# EAGLE design PAM8320 Amplifier Board R2 (EAGLE 9.6.2)
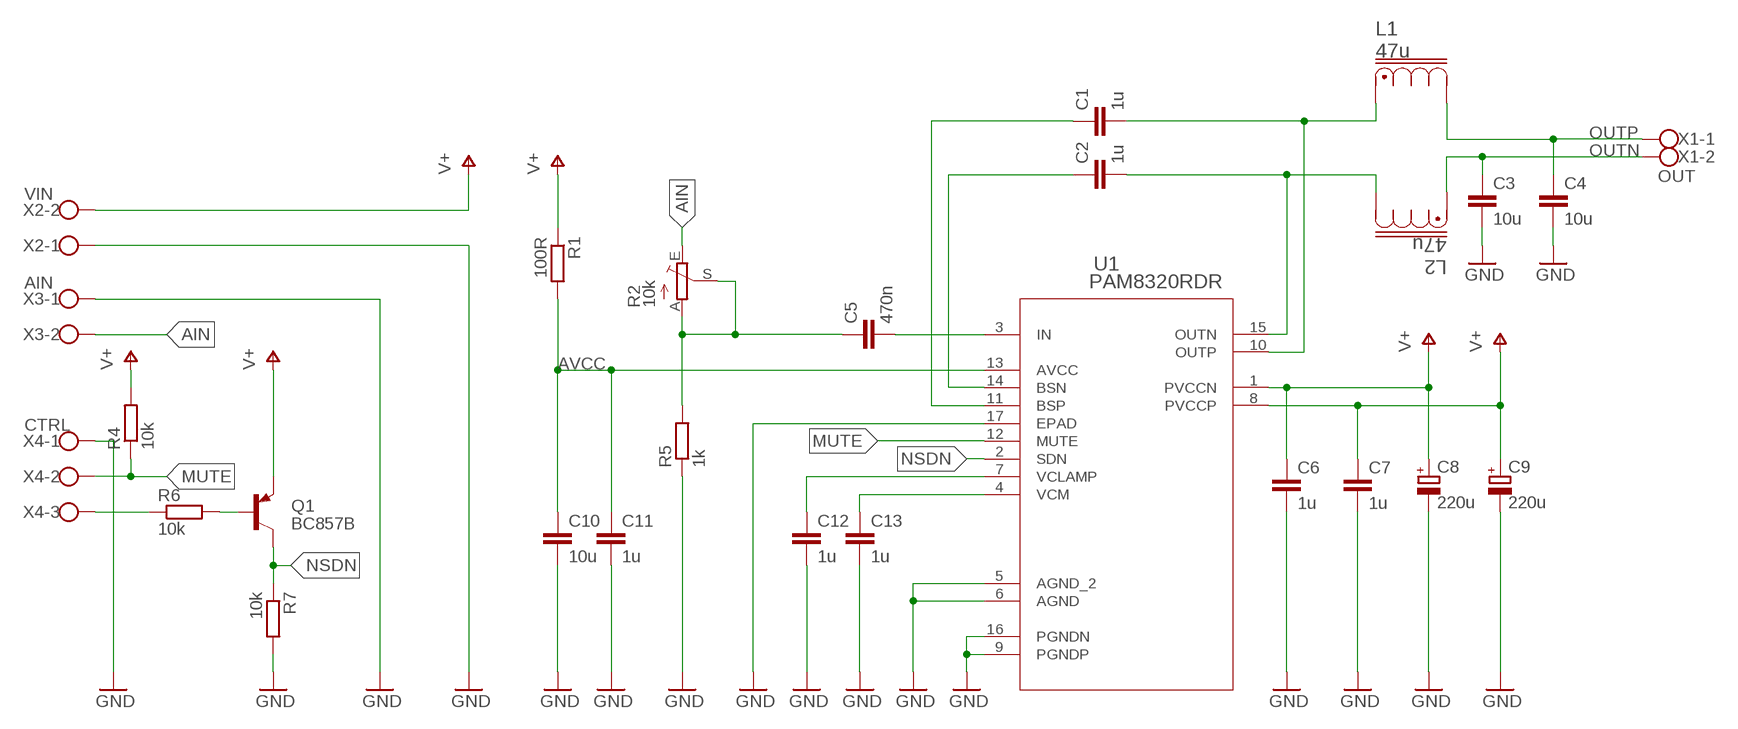
[diagram p0: schematic, sheet 1]

## Parts
C1  1u  C-EUC0805  [C0805]
C2  1u  C-EUC0805  [C0805]
C3  10u  C-EUC1206  [C1206]
C4  10u  C-EUC1206  [C1206]
C5  470n  C-EUC1206  [C1206]
C6  1u  C-EUC0805  [C0805]
C7  1u  C-EUC0805  [C0805]
C8  220u  CPOL-EUUD-10X10  [UD-10X10_NICHICON]
C9  220u  CPOL-EUUD-10X10  [UD-10X10_NICHICON]
C10  10u  C-EUC1206  [C1206]
C11  1u  C-EUC0805  [C0805]
C12  1u  C-EUC0805  [C0805]
C13  1u  C-EUC0805  [C0805]
L1  47u  DR127-470-R  [DR127]
L2  47u  DR127-470-R  [DR127]
Q1  BC857B  BC857BSMD  [SOT23-BEC]
R1  100R  R-EU_R0603  [R0603]
R2  10k  TRIM_EU-RJ9W  [RJ9W]
R4  10k  R-EU_R0603  [R0603]
R5  1k  R-EU_R0603  [R0603]
R6  10k  R-EU_R0603  [R0603]
R7  10k  R-EU_R0603  [R0603]
U1  PAM8320RDR  [SO-16EP_3P9X9P9_DIO]
X1  OUT  W237-102  [W237-102]
X2  VIN  W237-102  [W237-102]
X3  AIN  W237-102  [W237-102]
X4  CTRL  W237-103  [W237-103]

## Nets
AIN: R2.E X3.2
AVCC: C10.1 C11.1 R1.2 U1.13(AVCC)
BSN: C2.1 U1.14(BSN)
BSP: C1.1 U1.11(BSP)
GND: C3.2 C4.2 C6.2 C7.2 C8.- C9.- C10.2 C11.2 C12.2 C13.2 R5.1 R7.2 U1.5(AGND_2) U1.6(AGND) U1.9(PGNDP) U1.16(PGNDN) U1.17(EPAD) X2.1 X3.1 X4.1
MUTE: R4.1 U1.12(MUTE) X4.2
N$1: Q1.B R6.2
N$2: C12.1 U1.7(VCLAMP)
N$3: C13.1 U1.4(VCM)
N$5: C5.1 R2.A R2.S R5.2
N$6: C5.2 U1.3(IN)
N$7: R6.1 X4.3
NSDN: Q1.C R7.1 U1.2(SDN)
OUT_N: C2.2 L2.2 U1.15(OUTN)
OUT_P: C1.2 L1.1 U1.10(OUTP)
OUTN: C3.1 L2.1 X1.2
OUTP: C4.1 L1.2 X1.1
V+: C6.1 C7.1 C8.+ C9.+ Q1.E R1.1 R4.2 U1.1(PVCCN) U1.8(PVCCP) X2.2

## Library data of the parts
C1-C7 C10-C13 = rcl:C-EU: CAPACITOR, European symbol; SPICEPREFIX: C
C8 C9 = rcl:CPOL-EU: POLARIZED CAPACITOR, European symbol; SPICEPREFIX: C
L1 L2 = user:DR127-470-R: DR127 series SMD power inductor; COPYRIGHT: Copyright (C) 2023 Ultra Librarian. All rights reserved.; MANUFACTURER_PART_NUMBER: DR127-470-R; MFR_NAME: Eaton
Q1 = transistor-pnp:BC857*: PNP Transistror
R1 R4-R7 = rcl:R-EU_: RESISTOR, European symbol; SPICEPREFIX: R
R2 = pot:TRIM_EU-: POTENTIOMETER
U1 = user:PAM8320RDR; COPYRIGHT: Copyright (C) 2023 Ultra Librarian. All rights reserved.; MANUFACTURER_PART_NUMBER: PAM8320RDR; MFR_NAME: Diodes Inc
X1-X3 = con-wago-500:W237-102: WAGO SCREW CLAMP; MPN: 237-102; OC_FARNELL: unknown; OC_NEWARK: 70K9898
X4 = con-wago-500:W237-103: WAGO SCREW CLAMP; MPN: 237-103; OC_FARNELL: unknown; OC_NEWARK: 18M7116

## Board
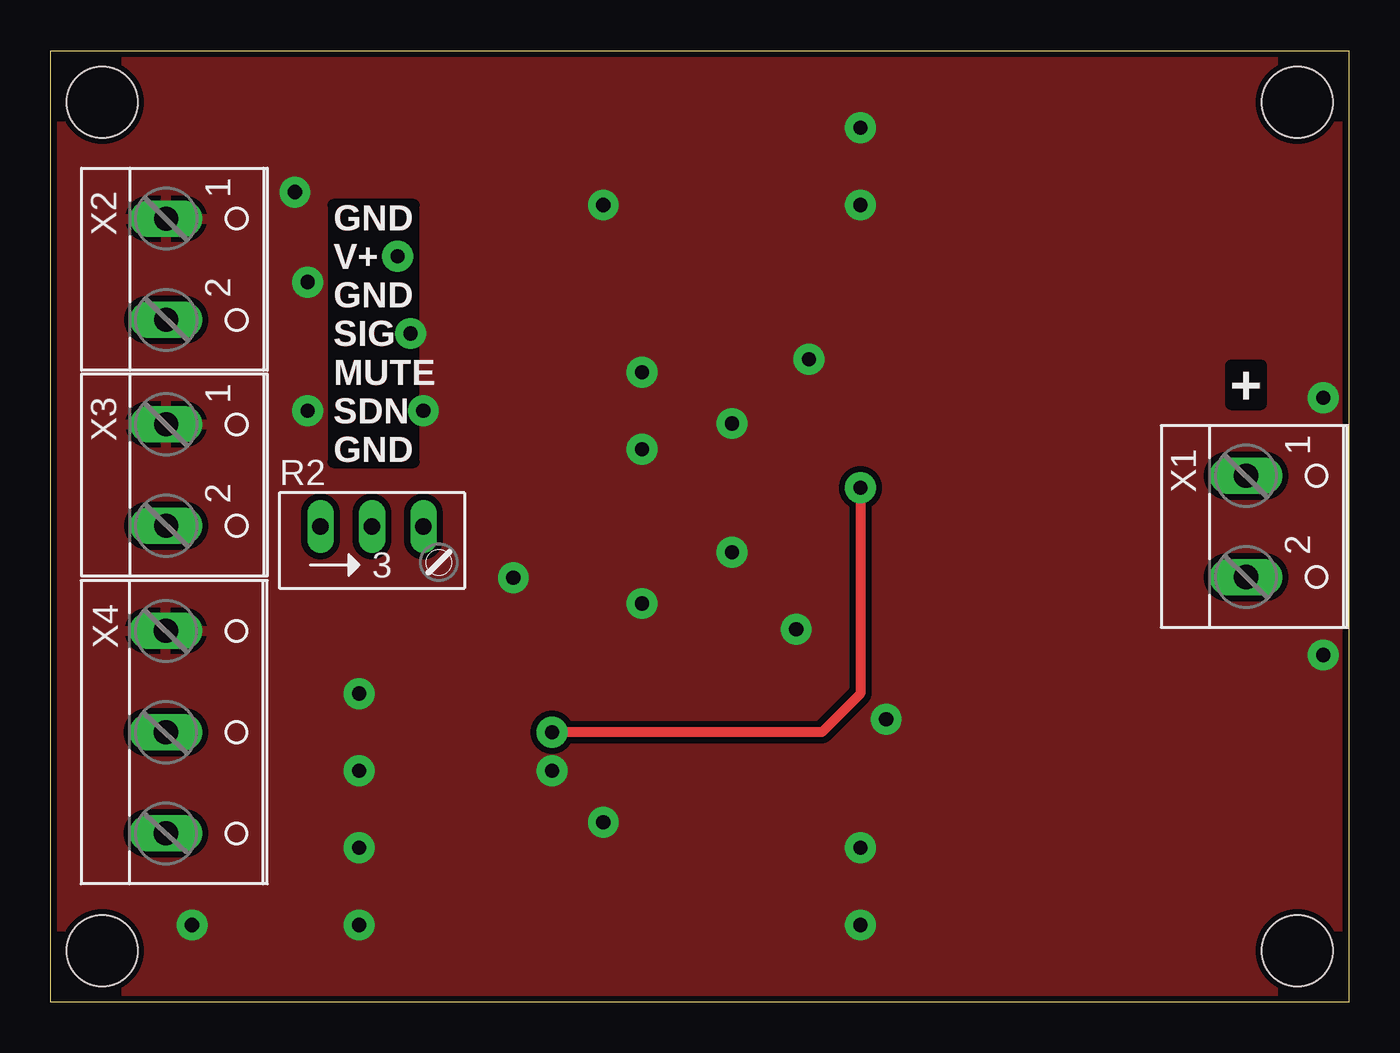
[diagram p1: board, top side]
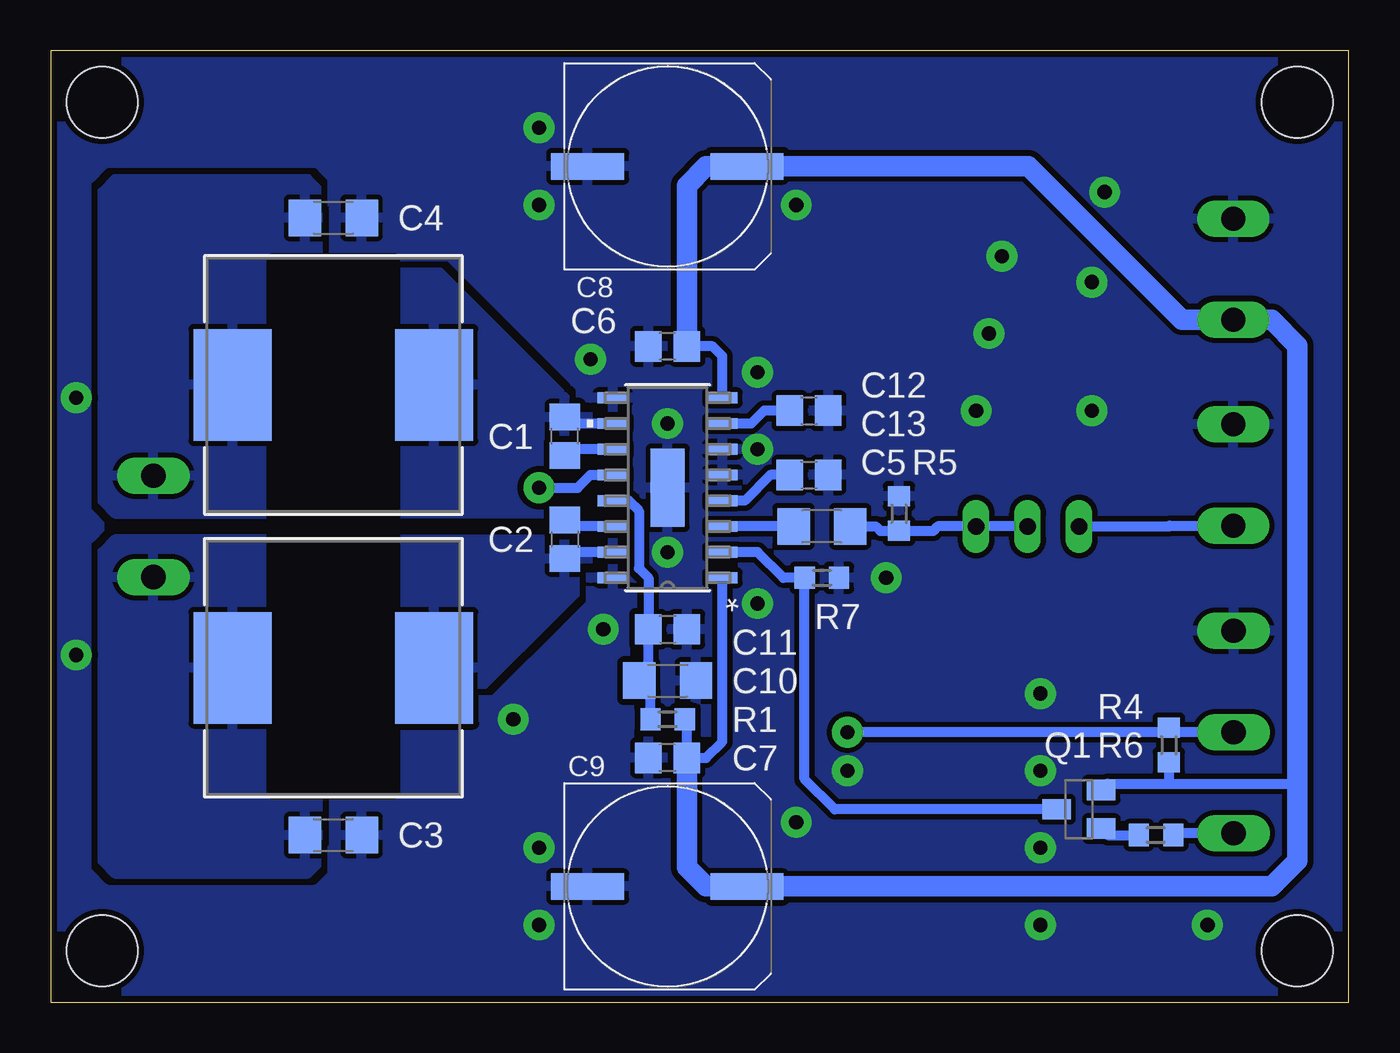
[diagram p2: board, bottom side, seen from below]

Size 64.14 x 46.99 mm. Coordinates in mm from the lower left corner, seen from the top.
Outline: 0,46.99 64.14,46.99 64.14,0 0,0 0,46.99
Copper layers (1*16): Top 0.035mm / dielectric 1.5mm / Bottom 0.035mm
Design rules "default *": minimum track width 0.2mm, minimum drill 0.35mm, track to track 0.25mm, track to pad 0.2mm, pad to pad 0.2mm, via to via 0.2mm, smd to smd 0.2mm, copper to edge 0.002540625mm, drill to drill 6mil, minimum pad ring 10mil, minimum via ring 8mil, stop-mask expansion 4mil, vias tented up to drill 0mil, thermal gap 0.25mm
Holes 3.5 mm at 2.54,44.45 61.59,44.45 2.54,2.54 61.59,2.54

### Footprints (pad centres in the part's own frame; a part is rotated, then mirrored left to right if it is on the bottom)
C0805 = smd 1.3 x 1.5: 1 -0.95,0; 2 0.95,0
C1206 = smd 1.6 x 1.8: 1 -1.4,0; 2 1.4,0
UD-10X10_NICHICON = smd 3.6 x 1.3: + 3.925,0; - -3.95,0
DR127 = smd 3.861 x 5.512: 1 -4.978,0; 2 4.978,0
SOT23-BEC = smd 1 x 1.4: B -0.95,-1.1; C 0,1.1; E 0.95,-1.1
R0603 = smd 1 x 1.1: 1 -0.85,0; 2 0.85,0
RJ9W = drill 0.813 long: A 2.54,0.635; E -2.54,0.635; S 0,0.635
SO-16EP_3P9X9P9_DIO = smd 1.499 x 0.533: 1 -2.705,4.445; 2 -2.705,3.175; 3 -2.705,1.905; 4 -2.705,0.635; 5 -2.705,-0.635; 6 -2.705,-1.905; 7 -2.705,-3.175; 8 -2.705,-4.445; 9 2.705,-4.445; 10 2.705,-3.175; 11 2.705,-1.905; 12 2.705,-0.635; 13 2.705,0.635; 14 2.705,1.905; 15 2.705,3.175; 16 2.705,4.445 | smd 1.676 x 3.861: 17 0,0
W237-102 = drill 1.194 long: 1 -2.5,-1.27; 2 2.5,-1.27
W237-103 = drill 1.194 long: 1 -5,-1.29; 2 0,-1.29; 3 5,-1.29

### Placement (x,y rotation side)
C1  38.73,27.94 90 bottom
C2  38.73,22.86 270 bottom
C3  50.17,8.26 0 bottom
C4  50.17,38.73 0 bottom
C5  26.04,23.5 180 bottom
C6  33.66,32.39 180 bottom
C7  33.66,12.07 180 bottom
C8  33.66,41.28 0 bottom
C9  33.66,5.71 0 bottom
C10  33.66,15.88 0 bottom
C11  33.66,18.41 0 bottom
C12  26.67,29.21 0 bottom
C13  26.67,26.04 0 bottom
L1  50.17,30.48 180 bottom
L2  50.17,16.51 0 bottom
Q1  13.34,9.53 90 bottom
R1  33.66,13.97 180 bottom
R2  15.88,22.86 0 top
R4  8.89,12.7 270 bottom
R5  22.23,24.13 270 bottom
R6  9.53,8.26 180 bottom
R7  26.04,20.96 0 bottom
U1  33.66,25.4 180 bottom
X1  60.33,23.5 270 top
X2  6.98,36.2 270 top
X3  6.98,26.04 270 top
X4  6.98,13.34 270 top

### Tracks (layer width: path | path; a pad name or v marks a point on that pad's centre or on a via)
AIN
  Bottom 0.5: R2.E 8.89,23.5 8.85,23.54 X3.2
AVCC
  Bottom 0.5: U1.13 35.58,24.77 35.07,24.26 35.07,21.42 34.61,20.96 C11.1 34.61,16.33 C10.1 34.51,15.33 R1.2
BSN
  Bottom 0.5: U1.14 38.42,23.5 C2.1
BSP
  Bottom 0.5: U1.11 38.42,27.3 C1.1
GND  (via drill 0.7 pad 1.52)
  other vias: 22.86,20.96 27.3,8.89 12.7,29.21 12.7,35.56 18.41,29.21 17.78,33.02 17.14,36.83 15.24,7.62 24.77,11.43 33.66,22.23 33.66,28.58 29.21,27.3 29.21,31.12 27.3,39.37 37.47,31.75 40.01,43.18 40.01,39.37 12.07,40.01 29.21,19.69 36.83,18.41 40.01,7.62 15.24,3.81 40.01,3.81 62.87,17.15 62.87,29.84 15.24,15.24 15.24,11.43 6.98,3.81 41.27,13.97
  pour Bottom (isolate 0.3): 35.56,21.59 36.83,21.59 37.47,20.96 37.47,19.69 43.18,13.97 48.9,13.97 50.17,12.7 50.17,5.71 49.53,5.08 34.93,5.08 33.66,6.35 33.66,12.7 34.93,13.97 34.93,20.96
  pour Bottom (isolate 0.3): 35.56,29.21 33.66,31.12 33.66,40.64 34.93,41.91 48.9,41.91 50.17,40.64 50.17,36.83 44.45,36.83 36.83,29.21
  pour Bottom (isolate 0.3, rank 4): -5.08,52.07 72.39,52.07 72.39,-1.9 -5.08,-1.9
  pour Bottom (isolate 0.25, rank 2): 3.81,33.66 2.54,32.39 2.54,6.98 3.81,5.71 31.75,5.71 32.38,6.35 32.38,11.43 34.29,13.34 34.29,20.96 34.93,21.59 34.93,30.48 33.66,31.75 33.66,33.66 33.02,34.29 33.02,40.01 31.75,41.28 15.88,41.28 8.26,33.66
  pour Top (isolate 0.3, rank 6): -0.63,48.26 65.41,48.26 65.41,-0.63 -0.63,-0.63
MUTE  (via drill 0.7 pad 1.52)
  Top 0.5: v40.01,25.4 40.01,15.24 38.1,13.34 v24.77,13.34
  Bottom 0.5: v40.01,25.4 38.1,25.4 37.47,26.04 U1.12 | X4.2 8.89,13.34 | 8.89,13.34 22.86,13.34 v24.77,13.34 | 8.89,13.34 R4.1
N$1
  Bottom 0.5: Q1.B 11.92,8.26 R6.2
N$2
  Bottom 0.5: C12.1 28.89,29.21 29.53,28.58 U1.7
N$3
  Bottom 0.5: C13.1 28.58,26.04 29.85,24.77 U1.4
N$5
  Bottom 0.5: R2.S R2.A 20.32,23.5 20.54,23.28 R5.2 23.15,23.28 23.37,23.5 C5.1
N$6
  Bottom 0.5: C5.2 U1.3
N$7
  Bottom 0.5: X4.3 8.6,8.34 R6.1
NSDN
  Bottom 0.5: U1.2 29.21,22.23 27.94,20.96 R7.1 26.89,11.01 25.4,9.53 Q1.C
OUT_N
  Bottom 0.5: U1.15 38.42,22.23 C2.2
  pour Bottom (isolate 0.3, rank 2): 35.56,22.86 35.56,21.59 36.2,20.96 37.47,20.96 37.47,19.69 43.18,13.97 47.62,13.97 47.62,22.86
OUT_P
  Bottom 0.5: U1.10 38.42,28.58 C1.2
  pour Bottom (isolate 0.3, rank 2): 37.47,24.13 46.99,24.13 46.99,36.83 44.45,36.83 37.47,29.84
OUTN
  pour Bottom (isolate 0.3, rank 2): 50.8,6.98 50.8,22.86 60.96,22.86 61.59,22.23 61.59,6.98 60.96,6.35 51.44,6.35
OUTP
  pour Bottom (isolate 0.3, rank 2): 50.8,40.01 51.44,40.64 60.96,40.64 61.59,40.01 61.59,24.77 60.96,24.13 50.8,24.13
V+
  Bottom 0.5: U1.8 30.95,31.9 31.44,32.39 C6.1 | R1.1 32.7,13.87 C7.1 31.75,12.07 30.95,12.87 U1.1 | Q1.E 11.92,10.8 8.89,10.8 | 8.89,10.8 2.54,10.8 | R4.2 8.89,10.8
  Bottom 1: C6.1 32.7,40.32 31.75,41.28 C8.+ 27.3,41.28 15.84,41.28 8.26,33.7 X2.2 3.81,33.7 2.54,32.42 2.54,15.88 2.54,10.8 2.54,6.98 3.81,5.71 C9.+ 31.75,5.71 32.7,6.67 C7.1

### Text on the board
Top: + | GND / V+ / GND / SIG / MUTE / SDN / GND
tNames: + | GND / V+ / GND / SIG / MUTE / SDN / GND